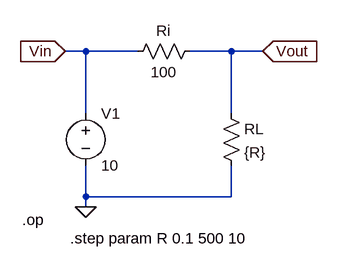
[diagram p0: schematic Max_Ausgangsleistung.asc]
Max_Ausgangsleistung.asc, the LTspice schematic file:
Version 4
SHEET 1 880 680
WIRE 0 48 -32 48
WIRE 80 48 0 48
WIRE 224 48 160 48
WIRE 272 48 224 48
WIRE 0 144 0 48
WIRE 224 144 224 48
WIRE 0 272 0 224
WIRE 224 272 224 224
WIRE 224 272 0 272
WIRE 0 288 0 272
FLAG 0 288 0
FLAG -32 48 Vin
IOPIN -32 48 In
FLAG 272 48 Vout
IOPIN 272 48 In
SYMBOL voltage 0 128 R0
SYMATTR InstName V1
SYMATTR Value 10
SYMBOL res 208 128 R0
SYMATTR InstName RL
SYMATTR Value {R}
SYMBOL res 176 32 R90
WINDOW 0 0 56 VBottom 2
WINDOW 3 32 56 VTop 2
SYMATTR InstName Ri
SYMATTR Value 100
TEXT -24 336 Left 2 !.step param R 0.1 500 10
TEXT -98 308 Left 2 !.op

The netlist it stands for:
* Max_Ausgangsleistung.asc
V1 Vin 0 10
RL Vout 0 {R}
Ri Vout Vin 100
.step param R 0.1 500 10
.op
.backanno
.end